# EAGLE schematic spectrum (EAGLE 7.2.0)
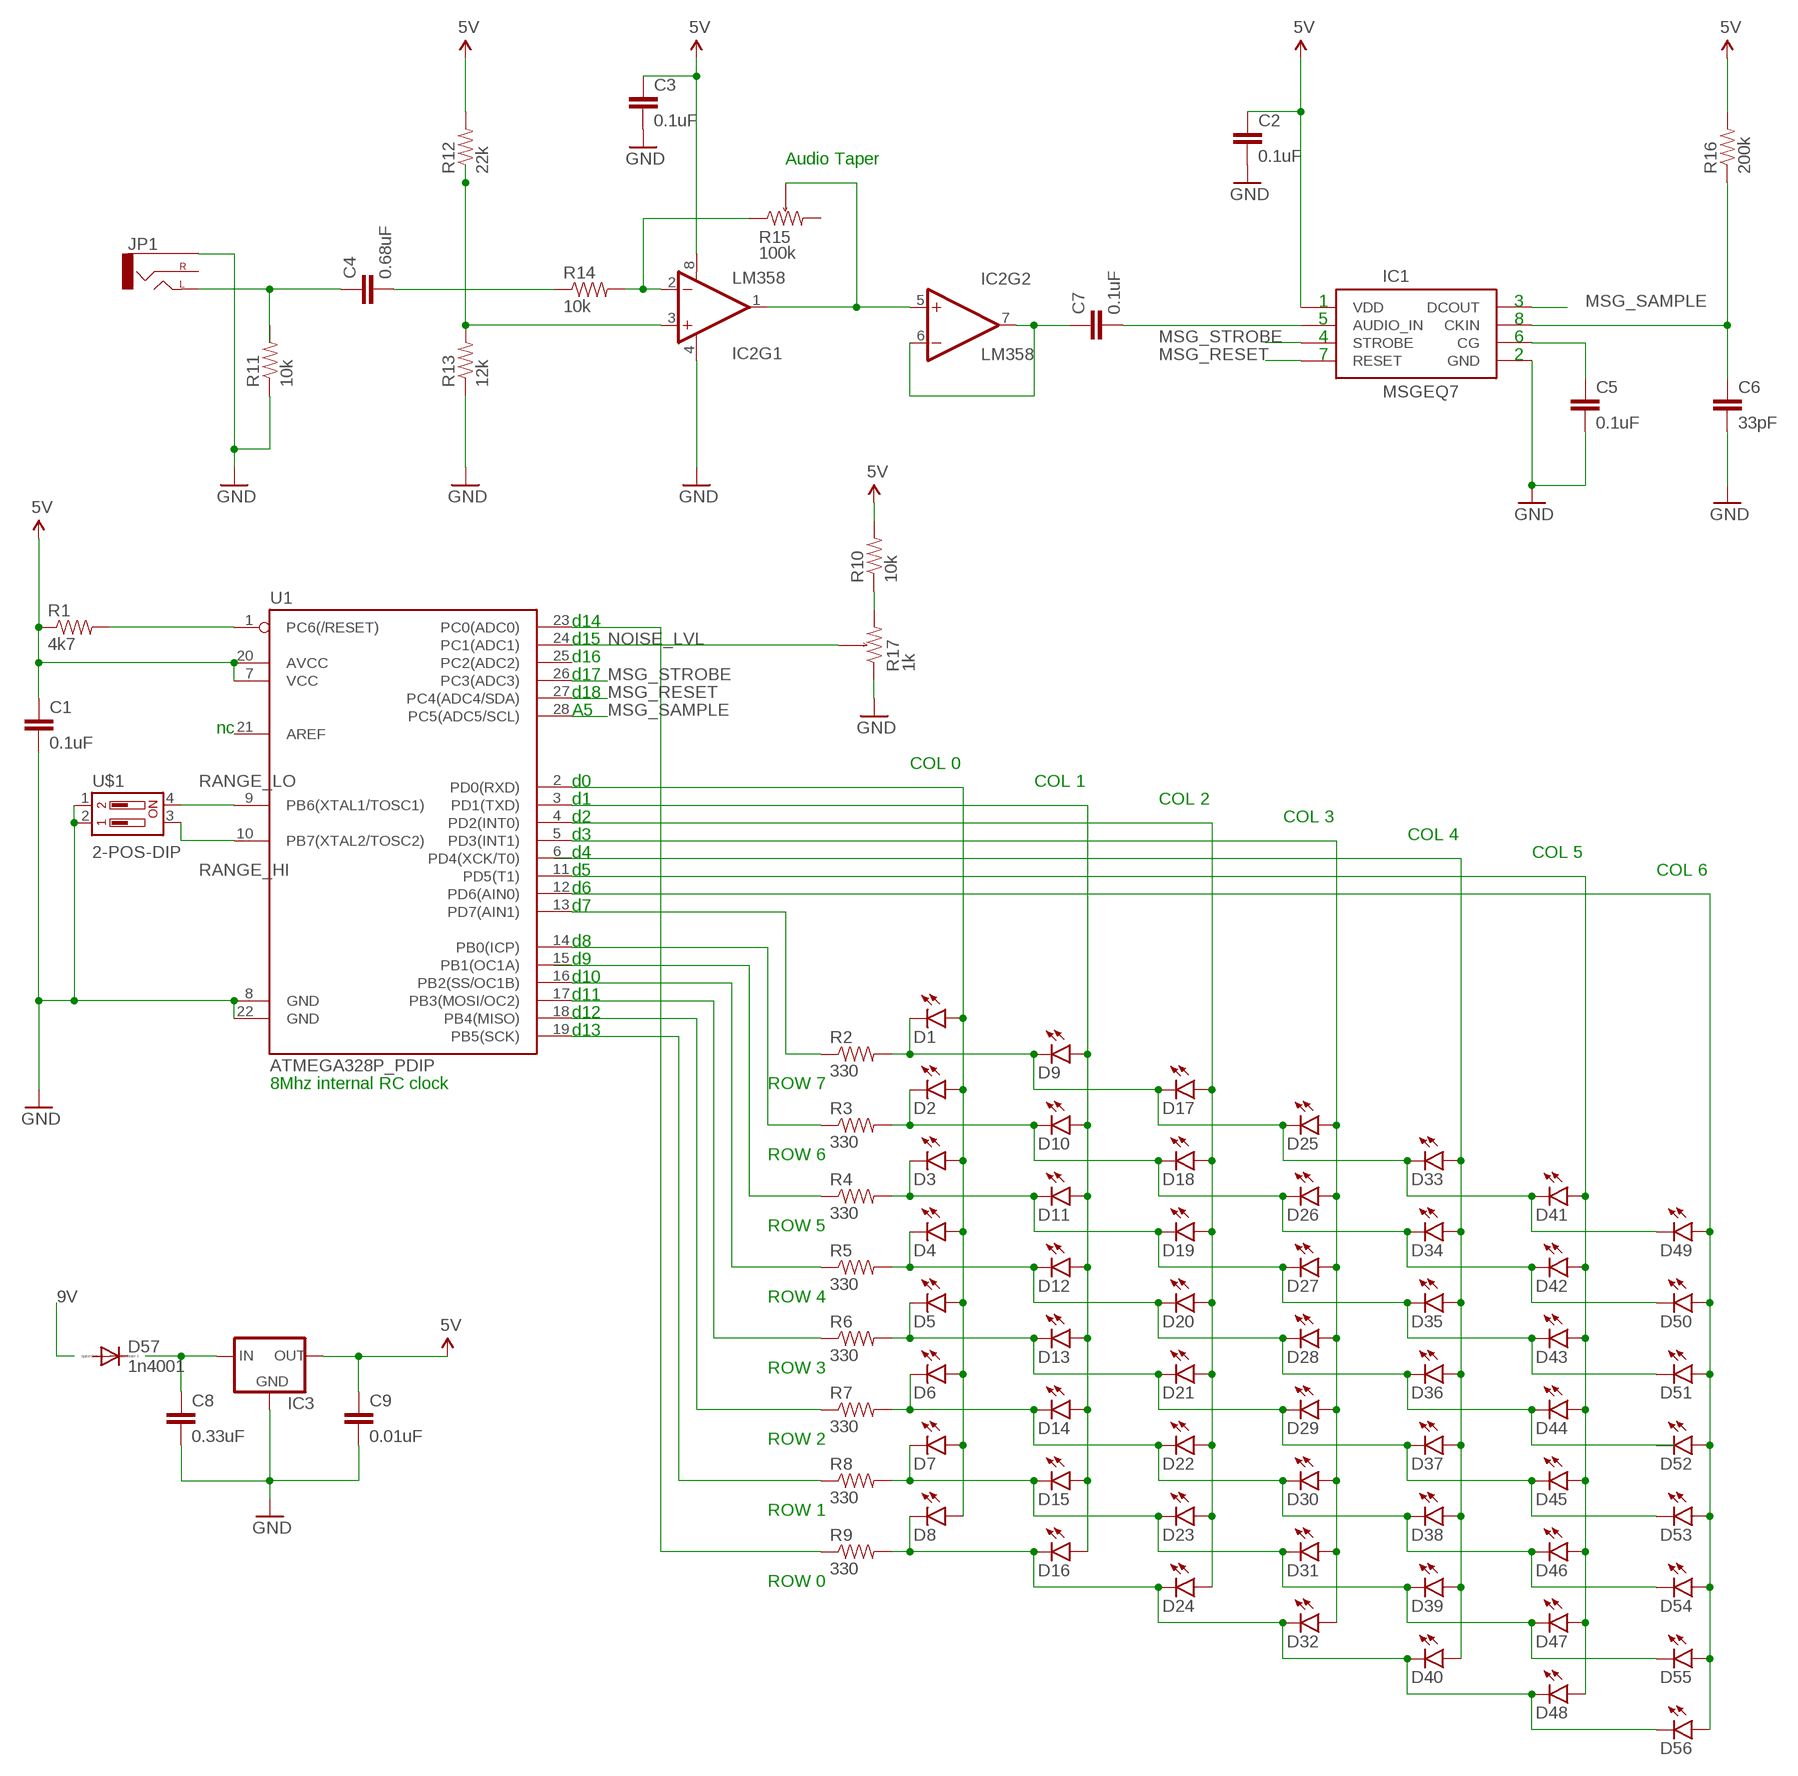
[diagram p0: schematic, sheet 1]

## Parts
C1  0.1uF  CAP0402-CAP  [0402-CAP]
C2  0.1uF  CAP0402-CAP  [0402-CAP]
C3  0.1uF  CAP0402-CAP  [0402-CAP]
C4  0.68uF  CAP0402-CAP  [0402-CAP]
C5  0.1uF  CAP0402-CAP  [0402-CAP]
C6  33pF  CAP0402-CAP  [0402-CAP]
C7  0.1uF  CAP0402-CAP  [0402-CAP]
C8  0.33uF  CAP0402-CAP  [0402-CAP]
C9  0.01uF  CAP0402-CAP  [0402-CAP]
D1  LED5MM  [LED5MM]
D2  LED5MM  [LED5MM]
D3  LED5MM  [LED5MM]
D4  LED5MM  [LED5MM]
D5  LED5MM  [LED5MM]
D6  LED5MM  [LED5MM]
D7  LED5MM  [LED5MM]
D8  LED5MM  [LED5MM]
D9  LED5MM  [LED5MM]
D10  LED5MM  [LED5MM]
D11  LED5MM  [LED5MM]
D12  LED5MM  [LED5MM]
D13  LED5MM  [LED5MM]
D14  LED5MM  [LED5MM]
D15  LED5MM  [LED5MM]
D16  LED5MM  [LED5MM]
D17  LED5MM  [LED5MM]
D18  LED5MM  [LED5MM]
D19  LED5MM  [LED5MM]
D20  LED5MM  [LED5MM]
D21  LED5MM  [LED5MM]
D22  LED5MM  [LED5MM]
D23  LED5MM  [LED5MM]
D24  LED5MM  [LED5MM]
D25  LED5MM  [LED5MM]
D26  LED5MM  [LED5MM]
D27  LED5MM  [LED5MM]
D28  LED5MM  [LED5MM]
D29  LED5MM  [LED5MM]
D30  LED5MM  [LED5MM]
D31  LED5MM  [LED5MM]
D32  LED5MM  [LED5MM]
D33  LED5MM  [LED5MM]
D34  LED5MM  [LED5MM]
D35  LED5MM  [LED5MM]
D36  LED5MM  [LED5MM]
D37  LED5MM  [LED5MM]
D38  LED5MM  [LED5MM]
D39  LED5MM  [LED5MM]
D40  LED5MM  [LED5MM]
D41  LED5MM  [LED5MM]
D42  LED5MM  [LED5MM]
D43  LED5MM  [LED5MM]
D44  LED5MM  [LED5MM]
D45  LED5MM  [LED5MM]
D46  LED5MM  [LED5MM]
D47  LED5MM  [LED5MM]
D48  LED5MM  [LED5MM]
D49  LED5MM  [LED5MM]
D50  LED5MM  [LED5MM]
D51  LED5MM  [LED5MM]
D52  LED5MM  [LED5MM]
D53  LED5MM  [LED5MM]
D54  LED5MM  [LED5MM]
D55  LED5MM  [LED5MM]
D56  LED5MM  [LED5MM]
D57  1n4001  1N4004  [DO41-10]
IC1  MSGEQ7DIL  [DIL-08]
IC2  LM358  [DIP08]
IC3  78LXX  [78LXX]
JP1  AUDIO-JACK1:1  [STEREOJACK2.5MM]
R1  4k7  RESISTOR0402-RES  [0402-RES]
R2  330  RESISTOR0402-RES  [0402-RES]
R3  330  RESISTOR0402-RES  [0402-RES]
R4  330  RESISTOR0402-RES  [0402-RES]
R5  330  RESISTOR0402-RES  [0402-RES]
R6  330  RESISTOR0402-RES  [0402-RES]
R7  330  RESISTOR0402-RES  [0402-RES]
R8  330  RESISTOR0402-RES  [0402-RES]
R9  330  RESISTOR0402-RES  [0402-RES]
R10  10k  RESISTOR0402-RES  [0402-RES]
R11  10k  RESISTOR0402-RES  [0402-RES]
R12  22k  RESISTOR0402-RES  [0402-RES]
R13  12k  RESISTOR0402-RES  [0402-RES]
R14  10k  RESISTOR0402-RES  [0402-RES]
R15  100k  POTENTIOMETER  [0603-ARV]
R16  200k  RESISTOR0402-RES  [0402-RES]
R17  1k  POTENTIOMETER  [0603-ARV]
U1  ATMEGA328P_PDIP  [DIL28-3]
U$1  2-POS-DIP  [CHS-02A]

## Nets
GND: C1.2 C2.2 C3.2 C5.2 C6.2 C8.2 C9.2 IC1.2(GND) IC2.4(V-) IC3.GND JP1.5(SLEEVE) R11.1 R13.1 R17.1 U1.8(GND) U1.22(GND) U$1.1 U$1.2
MSG_CLOCK: C6.1 IC1.8(CKIN) R16.1
MSG_RESET: IC1.7(RESET) U1.27(PC4(ADC4/SDA))
MSG_SAMPLE: IC1.3(DCOUT) U1.28(PC5(ADC5/SCL))
MSG_STROBE: IC1.4(STROBE) U1.26(PC3(ADC3))
N$1: D1.A D2.A D3.A D4.A D5.A D6.A D7.A D8.A U1.2(PD0(RXD))
N$2: D9.A D10.A D11.A D12.A D13.A D14.A D15.A D16.A U1.3(PD1(TXD))
N$3: D17.A D18.A D19.A D20.A D21.A D22.A D23.A D24.A U1.4(PD2(INT0))
N$4: D2.K(C) D10.K(C) D18.K(C) D26.K(C) D34.K(C) D42.K(C) D50.K(C) R3.2
N$5: R1.2 U1.1(PC6(/RESET))
N$6: D25.A D26.A D27.A D28.A D29.A D30.A D31.A D32.A U1.5(PD3(INT1))
N$7: D33.A D34.A D35.A D36.A D37.A D38.A D39.A D40.A
N$8: D41.A D42.A D43.A D44.A D45.A D46.A D47.A D48.A U1.11(PD5(T1))
N$9: D1.K(C) D9.K(C) D17.K(C) D25.K(C) D33.K(C) D41.K(C) D49.K(C) R2.2
N$10: D49.A D50.A D51.A D52.A D53.A D54.A D55.A D56.A U1.12(PD6(AIN0))
N$11: D3.K(C) D11.K(C) D19.K(C) D27.K(C) D35.K(C) D43.K(C) D51.K(C) R4.2
N$12: R2.1 U1.13(PD7(AIN1))
N$13: R3.1 U1.14(PB0(ICP))
N$14: R5.1 U1.16(PB2(SS/OC1B))
N$15: D4.K(C) D12.K(C) D20.K(C) D28.K(C) D36.K(C) D44.K(C) R5.2
N$16: D6.K(C) D14.K(C) D22.K(C) D30.K(C) D38.K(C) D46.K(C) D54.K(C) R7.2
N$17: D5.K(C) D13.K(C) D21.K(C) D29.K(C) D37.K(C) D45.K(C) D53.K(C) R6.2
N$18: R6.1 U1.17(PB3(MOSI/OC2))
N$19: R4.1
N$20: R7.1 U1.18(PB4(MISO))
N$21: D7.K(C) D15.K(C) D23.K(C) D31.K(C) D39.K(C) D47.K(C) D55.K(C) R8.2
N$22: R8.1 U1.19(PB5(SCK))
N$23: D8.K(C) D16.K(C) D24.K(C) D32.K(C) D40.K(C) D48.K(C) D56.K(C) R9.2
N$24: R9.1 U1.23(PC0(ADC0))
N$25: C4.1 JP1.1(LEFT)
N$26: C8.1 IC3.IN
N$27: C7.2 IC1.5(AUDIO_IN)
N$28: C7.1 IC2.6(-IN) IC2.7(OUT)
N$29: IC2.1(OUT) IC2.5(+IN) R15.3 R15.4 R15.5 R15.6 R15.7 R15.8
N$30: C5.1 IC1.6(CG)
N$31: IC2.3(+IN) R12.1 R13.2
N$32: R10.1 R17.2
N$33: C4.2 R14.1
N$34: IC2.2(-IN) R14.2 R15.1
NOISE_LVL: R17.3 R17.4 R17.5 R17.6 R17.7 R17.8 U1.24(PC1(ADC1))
RANGE_HI: U1.10(PB7(XTAL2/TOSC2)) U$1.3
RANGE_LO: U1.9(PB6(XTAL1/TOSC1)) U$1.4
VCC: C1.1 C2.1 C3.1 C9.1 IC1.1(VDD) IC2.8(V+) IC3.OUT R1.1 R10.2 R12.2 R16.2 U1.7(VCC) U1.20(AVCC) ; supply symbol labelled 5V
Unconnected: D52.K(C) D57.A D57.C JP1.4(RIGHT) R11.2 R15.2 U1.6(PD4(XCK/T0)) U1.15(PB1(OC1A)) U1.21(AREF) U1.25(PC2(ADC2))

## Notes on the sheet
- Audio Taper
- 1 | 3
- 5 | 8
- 4 | 6
- 7 | 2
- d14
- d15
- d16
- d17
- d18
- A5
- nc
- COL 0
- d0 | COL 1
- d1 | COL 2
- d2 | COL 3
- d3 | COL 4
- d4 | COL 5
- d5 | COL 6
- d6
- d7
- d8
- d9
- d10
- d11
- d12
- d13
- 8Mhz internal RC clock | ROW 7
- ROW 6
- ROW 5
- ROW 4
- ROW 3
- ROW 2
- ROW 1
- ROW 0

## Library data of the parts
C1-C9 = SparkFun-Capacitors:CAP: Capacitor Standard 0603 ceramic capacitor, and 0.1" leaded capacitor.
D1-D56 = SparkFun-LED:LED: LEDs Standard schematic elements and footprints for 5mm, 3mm, 1206, and 0603 sized LEDs. 5mm - Spark Fun Electronics SKU : COM-00529 (and others)
D57 = diode:1N4004: DIODE general purpose rectifier, 1 A
IC1 = SparkFun-AnalogIC:MSGEQ7: 7-band graphic equalizer
IC2 = SparkFun-AnalogIC:LM358: Jellybean op-amp; PROD_ID: IC-09172
IC3 = v-reg:78LXX: VOLTAGE REGULATOR
JP1 = SparkFun-Connectors:AUDIO-JACK: 3.5mm Audio Jack Simple 3.5mm common PCB mount audio jack. Variant PTH is our storefront SKU PRT-08032
R1-R14 R16 = SparkFun-Passives:RESISTOR: Resistor Basic schematic elements and footprints for 0603, 1206, and PTH resistors.
R15 R17 = SparkFun-Passives:POTENTIOMETER
U1 = SparkFun-DigitalIC:ATMEGA328P_PDIP: uC used in the Arduino 32kb flash, 1k EEPROM, 2k SRAM This is the through-hole version of this chip.
U$1 = SparkFun-Electromechanical:2-POS-DIP: SMD dip switch 2 positions; PROD_ID: SWCH-12372